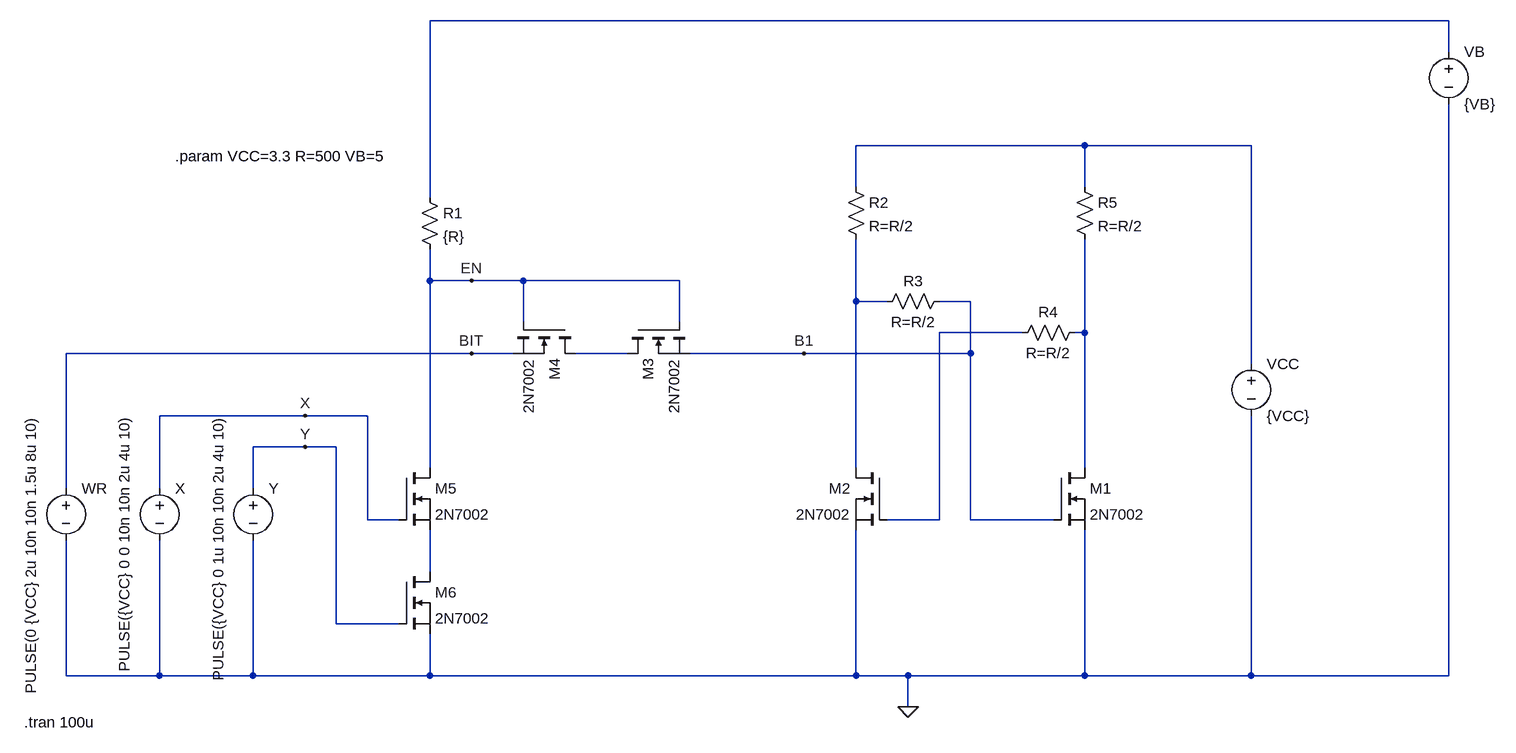
[diagram p0: schematic bitcell_nmos.asc]
bitcell_nmos.asc, the LTspice schematic file:
Version 4.1
SHEET 1 1464 744
WIRE 1376 -352 -192 -352
WIRE 1376 -304 1376 -352
WIRE 816 -160 464 -160
WIRE 1072 -160 816 -160
WIRE 464 -96 464 -160
WIRE 816 -96 816 -160
WIRE -192 -80 -192 -352
WIRE -192 48 -192 0
WIRE -128 48 -192 48
WIRE -48 48 -128 48
WIRE 192 48 -48 48
WIRE 464 80 464 -16
WIRE 512 80 464 80
WIRE 640 80 592 80
WIRE -48 112 -48 48
WIRE 192 112 192 48
WIRE 720 128 592 128
WIRE 816 128 816 -16
WIRE 816 128 800 128
WIRE -128 160 -752 160
WIRE -64 160 -128 160
WIRE 112 160 32 160
WIRE 384 160 208 160
WIRE 640 160 640 80
WIRE 640 160 384 160
WIRE 1072 176 1072 -160
WIRE -384 256 -608 256
WIRE -288 256 -384 256
WIRE -384 304 -464 304
WIRE -336 304 -384 304
WIRE -192 336 -192 48
WIRE 464 336 464 80
WIRE 816 336 816 128
WIRE -752 368 -752 160
WIRE -608 368 -608 256
WIRE -464 368 -464 304
WIRE -288 416 -288 256
WIRE -240 416 -288 416
WIRE 592 416 592 128
WIRE 592 416 512 416
WIRE 640 416 640 160
WIRE 768 416 640 416
WIRE -192 496 -192 432
WIRE -336 576 -336 304
WIRE -240 576 -336 576
WIRE -752 656 -752 448
WIRE -608 656 -608 448
WIRE -608 656 -752 656
WIRE -464 656 -464 448
WIRE -464 656 -608 656
WIRE -192 656 -192 592
WIRE -192 656 -464 656
WIRE 464 656 464 432
WIRE 464 656 -192 656
WIRE 544 656 464 656
WIRE 816 656 816 432
WIRE 816 656 544 656
WIRE 1072 656 1072 256
WIRE 1072 656 816 656
WIRE 1376 656 1376 -224
WIRE 1376 656 1072 656
WIRE 544 704 544 656
FLAG 544 704 0
FLAG 384 160 B1
FLAG -128 160 BIT
FLAG -128 48 EN
FLAG -384 256 X
FLAG -384 304 Y
SYMBOL nmos 768 336 R0
SYMATTR InstName M1
SYMATTR Value 2N7002
SYMBOL nmos 512 336 M0
SYMATTR InstName M2
SYMATTR Value 2N7002
SYMBOL nmos 112 112 M90
SYMATTR InstName M3
SYMATTR Value 2N7002
SYMBOL nmos 32 112 R90
SYMATTR InstName M4
SYMATTR Value 2N7002
SYMBOL nmos -240 336 R0
SYMATTR InstName M5
SYMATTR Value 2N7002
SYMBOL nmos -240 496 R0
SYMATTR InstName M6
SYMATTR Value 2N7002
SYMBOL res -208 -96 R0
SYMATTR InstName R1
SYMATTR Value {R}
SYMBOL res 448 -112 R0
SYMATTR InstName R2
SYMATTR Value R=R/2
SYMBOL res 800 -112 R0
SYMATTR InstName R5
SYMATTR Value R=R/2
SYMBOL voltage 1376 -320 R0
WINDOW 123 0 0 Left 0
WINDOW 39 0 0 Left 0
SYMATTR InstName VB
SYMATTR Value {VB}
SYMBOL voltage 1072 160 R0
SYMATTR InstName VCC
SYMATTR Value {VCC}
SYMBOL voltage -608 352 R0
WINDOW 3 -54 -99 VRight 2
WINDOW 123 0 0 Left 0
WINDOW 39 0 0 Left 0
SYMATTR Value PULSE({VCC} 0 0 10n 10n 2u 4u 10)
SYMATTR InstName X
SYMBOL voltage -752 352 R0
WINDOW 3 -54 -99 VRight 2
WINDOW 123 0 0 Left 0
WINDOW 39 0 0 Left 0
SYMATTR Value PULSE(0 {VCC} 2u 10n 10n 1.5u 8u 10)
SYMATTR InstName WR
SYMBOL voltage -464 352 R0
WINDOW 3 -54 -99 VRight 2
WINDOW 123 0 0 Left 0
WINDOW 39 0 0 Left 0
SYMATTR Value PULSE({VCC} 0 1u 10n 10n 2u 4u 10)
SYMATTR InstName Y
SYMBOL res 608 64 R90
WINDOW 0 0 56 VBottom 2
WINDOW 3 32 56 VTop 2
SYMATTR InstName R3
SYMATTR Value R=R/2
SYMBOL res 816 112 R90
WINDOW 0 0 56 VBottom 2
WINDOW 3 32 56 VTop 2
SYMATTR InstName R4
SYMATTR Value R=R/2
TEXT -584 -144 Left 2 !.param VCC=3.3 R=500 VB=5
TEXT -816 728 Left 2 !.tran 100u

The netlist it stands for:
* bitcell_nmos.asc
M1 N005 B1 0 0 2N7002
M2 N003 N004 0 0 2N7002
M3 N006 EN B1 B1 2N7002
M4 N006 EN BIT BIT 2N7002
M5 EN X N007 N007 2N7002
M6 N007 Y 0 0 2N7002
R1 N001 EN {R}
R2 N002 N003 R=R/2
R5 N002 N005 R=R/2
VB N001 0 {VB}
VCC N002 0 {VCC}
V§X X 0 PULSE({VCC} 0 0 10n 10n 2u 4u 10)
V§WR BIT 0 PULSE(0 {VCC} 2u 10n 10n 1.5u 8u 10)
V§Y Y 0 PULSE({VCC} 0 1u 10n 10n 2u 4u 10)
R3 B1 N003 R=R/2
R4 N005 N004 R=R/2
.model NMOS NMOS
.model PMOS PMOS
.lib standard.mos
.param VCC=3.3 R=500 VB=5
.tran 100u
.backanno
.end